# EAGLE design GC2-xHAT-v1.0 (EAGLE 9.2.2)
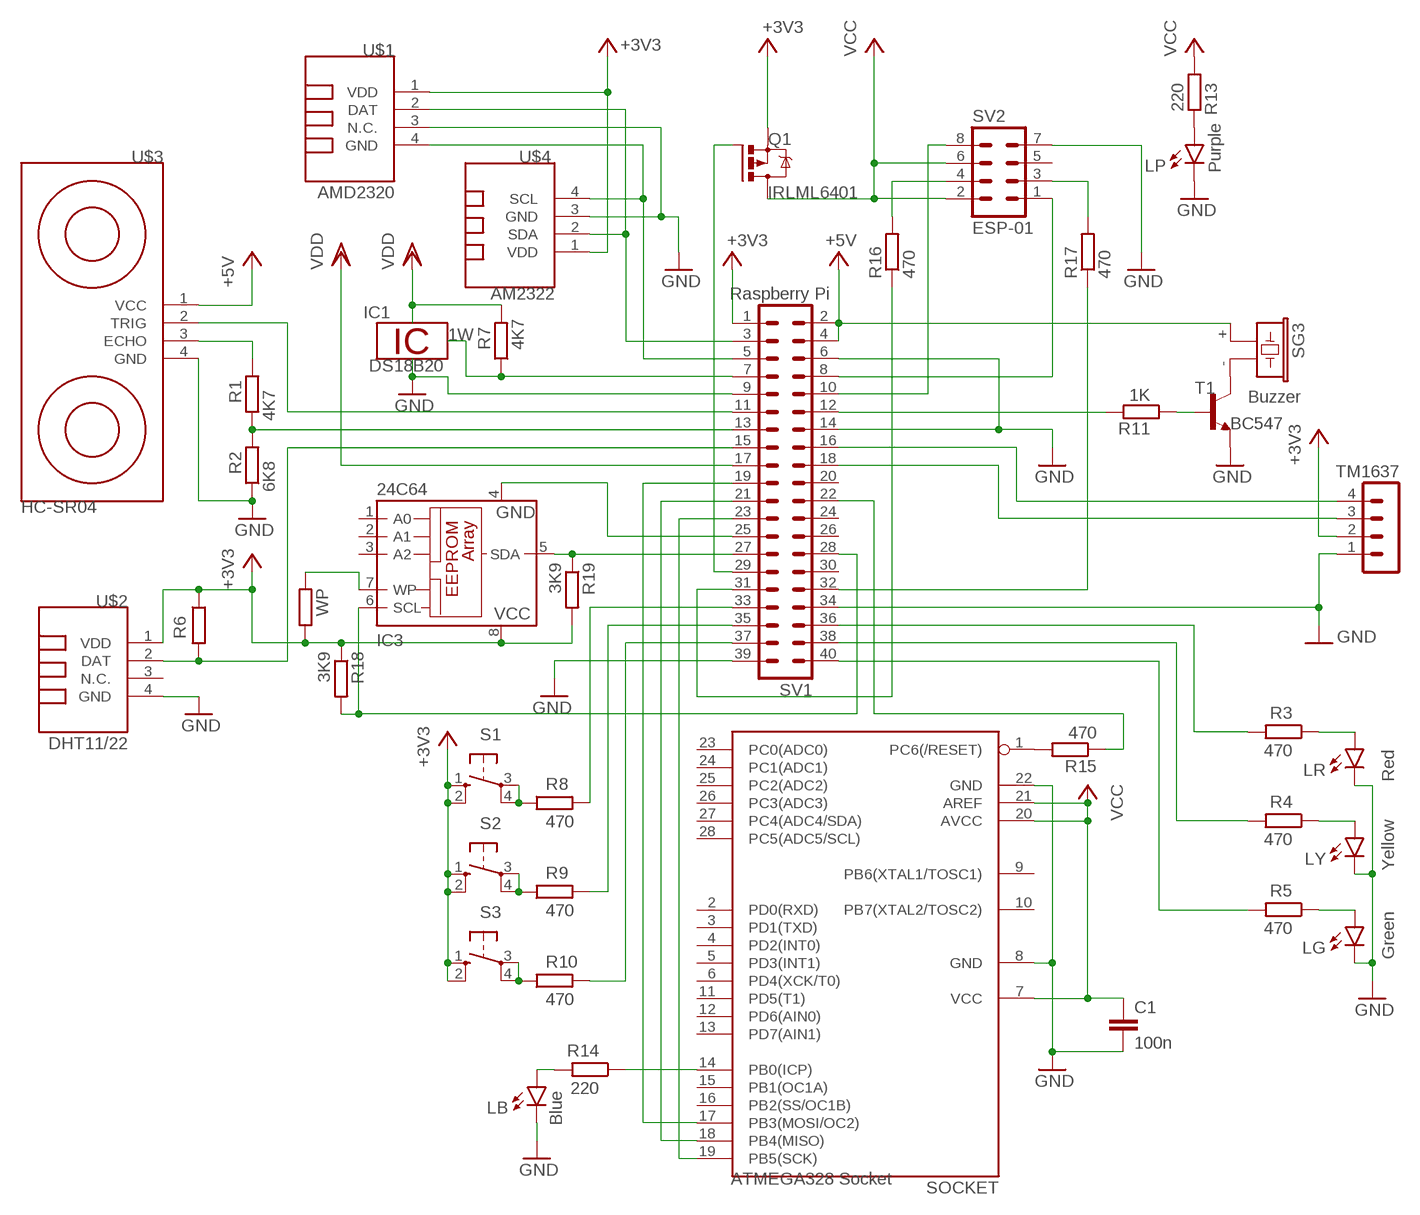
[diagram p0: schematic, sheet 1]

## Parts
C1  100n  C-EU025-024X044  [C025-024X044]
IC1  DS18B20  [TO92-]
IC3  24C64  24C32ASN  [SO-08]
LB  Blue  LED3MM  [LED3MM]
LG  Green  LED3MM  [LED3MM]
LP  Purple  LED3MM  [LED3MM]
LR  Red  LED3MM  [LED3MM]
LY  Yellow  LED3MM  [LED3MM]
Q1  IRLML6401  IRLML5203  [MICRO3]
R1  4K7  R-EU_0309/V  [0309V]
R2  6K8  R-EU_0309/V  [0309V]
R3  470  R-EU_0309/V  [0309V]
R4  470  R-EU_0309/V  [0309V]
R5  470  R-EU_0309/V  [0309V]
R6  4K7  R-EU_0309/V  [0309V]
R7  4K7  R-EU_0309/V  [0309V]
R8  470  R-EU_0309/V  [0309V]
R9  470  R-EU_0309/V  [0309V]
R10  470  R-EU_0309/V  [0309V]
R11  1K  R-EU_0309/V  [0309V]
R13  220  R-EU_0309/V  [0309V]
R14  220  R-EU_0309/V  [0309V]
R15  470  R-EU_0204/7  [0204/7]
R16  470  R-EU_0204/7  [0204/7]
R17  470  R-EU_0204/7  [0204/7]
R18  3K9  R-EU_R1206  [R1206]
R19  3K9  R-EU_R1206  [R1206]
S1  10-XX  [B3F-10XX]
S2  10-XX  [B3F-10XX]
S3  10-XX  [B3F-10XX]
SG3  Buzzer  F/CM12P  [F/CM12P]
SOCKET  ATMEGA328 Socket  MEGA8-P  [DIL28-3]
SV1  Raspberry Pi  MA20-2  [MA20-2]
SV2  ESP-01  MA04-2  [MA04-2]
SW  WP  R-EU_M1406  [M1406]
T1  BC547  [TO92]
TM1637  MA04-1  [MA04-1]
U$1  AMD2320  TEMP-HUM-SENSOR-DHT11  [TEMP-HUM-SENSOR-DHT11]
U$2  DHT11/22  TEMP-HUM-SENSOR-DHT11  [TEMP-HUM-SENSOR-DHT11]
U$3  HC-SR04  ULTRASONIC-HC-SR04#V  [ULTRASONIC-HC-SR04#V]
U$4  AM2322  TEMP-HUM-SENSOR-AM2322  [TEMP-HUM-SENSOR-AM2322]

## Nets
1W: R7.1 SV1.7
+3V3: IC3.8(VCC) Q1.2(S) R6.1 R18.1 R19.2 S1.1(S) S1.2(S1) S2.1(S) S2.2(S1) S3.1(S) S3.2(S1) SV1.1 SW.1 TM1637.2 U$1.1(VDD) U$2.1(VDD) U$4.1(VDD)
+5V: SG3.+ SV1.2 SV1.4 U$3.1(VCC)
GND: C1.2 LB.K(C) LG.K(C) LP.K(C) LR.K(C) LY.K(C) R2.1 SOCKET.8(GND) SOCKET.22(GND) SV1.6 SV1.9 SV1.14 SV1.34 SV1.39 SV2.7 T1.1(E) TM1637.1 U$1.3(N.C.) U$2.4(GND) U$3.4(GND) U$4.3(GND)
N$1: LY.A R4.1
N$2: SV1.3 U$1.2(DAT) U$4.2(SDA)
N$3: SV1.5 U$1.4(GND) U$4.4(SCL)
N$4: R1.1 R2.2 SV1.13
N$5: R9.1 S2.3(P) S2.4(P1)
N$6: SV1.11 U$3.2(TRIG)
N$7: R8.1 S1.3(P) S1.4(P1)
N$8: R11.1 T1.2(B)
N$9: R17.2 SV2.3
N$10: SOCKET.17(PB3(MOSI/OC2)) SV1.19
N$11: SOCKET.18(PB4(MISO)) SV1.21
N$12: SOCKET.19(PB5(SCK)) SV1.23
N$13: LP.A R13.2
N$14: LG.A R5.1
N$15: R8.2 SV1.33
N$16: R9.2 SV1.35
N$17: R10.2 SV1.37
N$18: R17.1 SV1.32
N$19: Q1.1(G) SV1.29
N$20: R15.2 SOCKET.1(PC6(/RESET))
N$21: R14.1 SOCKET.14(PB0(ICP))
N$22: R10.1 S3.3(P) S3.4(P1)
N$23: R16.2 SV2.4
N$24: SV1.8 SV2.1
N$25: SV1.10 SV2.8
N$26: R11.2 SV1.12
N$27: R15.1 SV1.22
N$28: SV1.16 TM1637.4
N$29: R6.2 SV1.15 U$2.2(DAT)
N$30: LB.A R14.2
N$31: IC3.5(SDA) R19.1 SV1.27
N$32: IC3.6(SCL) R18.2 SV1.28
N$33: R16.1 SV1.31
N$37: R4.2 SV1.38
N$38: R3.2 SV1.36
N$39: LR.A R3.1
N$40: SG3.- T1.3(C)
N$41: R1.2 U$3.3(ECHO)
N$42: SV1.18 TM1637.3
N$43: IC3.7(WP) SW.2
N$44: R5.2 SV1.40
N$45: IC3.4(GND) SV1.25
VCC: C1.1 Q1.3(D) R13.1 SOCKET.7(VCC) SOCKET.20(AVCC) SOCKET.21(AREF) SV2.2 SV2.6
VDD: R7.2 SV1.17
Unconnected: IC3.1(A0) IC3.2(A1) IC3.3(A2) SOCKET.2(PD0(RXD)) SOCKET.3(PD1(TXD)) SOCKET.4(PD2(INT0)) SOCKET.5(PD3(INT1)) SOCKET.6(PD4(XCK/T0)) SOCKET.9(PB6(XTAL1/TOSC1)) SOCKET.10(PB7(XTAL2/TOSC2)) SOCKET.11(PD5(T1)) SOCKET.12(PD6(AIN0)) SOCKET.13(PD7(AIN1)) SOCKET.15(PB1(OC1A)) SOCKET.16(PB2(SS/OC1B)) SOCKET.23(PC0(ADC0)) SOCKET.24(PC1(ADC1)) SOCKET.25(PC2(ADC2)) SOCKET.26(PC3(ADC3)) SOCKET.27(PC4(ADC4/SDA)) SOCKET.28(PC5(ADC5/SCL)) SV1.20 SV1.24 SV1.26 SV1.30 SV2.5 U$2.3(N.C.)

## Power pins joined to a net without a drawn wire
1W: IC1.2
GND: IC1.1
VDD: IC1.3

## Library data of the parts
C1 = rcl:C-EU: CAPACITOR, European symbol; SPICEPREFIX: C
IC1 = 1wire:DS18B20: Programmable Resolution Digital Thermometer This chip provides a onewire thermosensor with approx. 0.5°C accuracy. A programmable over/undertemperure alarm is available. The precision can be set from 9..12 bits. Notes: Vdd must be applied for accurate measurements at low temperatures, as the parasite power circuit otherwise heats the sensor. If parasite power is used, Vdd has to be connected to GND. The DS1822 is a low-cost thermometer chip, the DS18S20 is similar to the DS18B20, but with 9 Bit precision only. Author: Jan Kandziora <jjj@gmx.de>
IC3 = microchip:24*: Serial EEPROM I2C; MPN: IS24C32A-2GLI; OC_FARNELL: 1224413; OC_NEWARK: 43M4588
LB LG LP LR LY = led:LED: LED OSRAM: - CHIPLED LG R971, LG N971, LY N971, LG Q971, LY Q971, LO R971, LY R971 LH N974, LH R974 LS Q976, LO Q976, LY Q976 LO Q996 - Hyper CHIPLED LW Q18S LB Q993, LB Q99A, LB R99A - SideLED LS A670, LO A670, LY A670, LG A670, LP A670 LB A673, LV A673, LT A673, LW A673 LH A674 LY A675 LS A676, LA A676, LO A676, LY A676, LW A676 LS A679, LY A679, LG A679 - Hyper Micro SIDELED® LS Y876, LA Y876, LO Y876, LY Y876 LT Y87S - SmartLED LW L88C, LW L88S LB L89C, LB L89S, LG L890 LS L89K, LO L89K, LY L89K LS L896, LA L896, LO L896, LY L896 - TOPLED LS T670, LO T670, LY T670, LG T670, LP T670 LSG T670, LSP T670, LSY T670, LOP T670, LYG T670 LG T671, LOG T671, LSG T671 LB T673, LV T673, LT T673, LW T673 LH T674 LS T676, LA T676, LO T676, LY T676, LB T676, LH T676, LSB T676, LW T676 LB T67C, LV T67C, LT T67C, LS T67K, LO T67K, LY T67K, LW E67C LS E67B, LA E67B, LO E67B, LY E67B, LB E67C, LV E67C, LT E67C LW T67C LS T679, LY T679, LG T679 LS T770, LO T770, LY T770, LG T770, LP T770 LB T773, LV T773, LT T773, LW T773 LH T774 LS E675, LA E675, LY E675, LS T675 LS T776, LA T776, LO T776, LY T776, LB T776 LHGB T686 LT T68C, LB T68C - Hyper Mini TOPLED® LB M676 - Mini TOPLED Santana® LG M470 LS M47K, LO M47K, LY M47K Source: http://www.osram.convergy.de LUXEON: - LUMILED® LXK2-PW12-R00, LXK2-PW12-S00, LXK2-PW14-U00, LXK2-PW14-V00 LXK2-PM12-R00, LXK2-PM12-S00, LXK2-PM14-U00 LXK2-PE12-Q00, LXK2-PE12-R00, LXK2-PE12-S00, LXK2-PE14-T00, LXK2-PE14-U00 LXK2-PB12-K00, LXK2-PB12-L00, LXK2-PB12-M00, LXK2-PB14-N00, LXK2-PB14-P00, LXK2-PB14-Q00 LXK2-PR12-L00, LXK2-PR12-M00, LXK2-PR14-Q00, LXK2-PR14-R00 LXK2-PD12-Q00, LXK2-PD12-R00, LXK2-PD12-S00 LXK2-PH12-R00, LXK2-PH12-S00 LXK2-PL12-P00, LXK2-PL12-Q00, LXK2-PL12-R00 Source: www.luxeon.com KINGBRIGHT: KA-3528ASYC Source: www.kingbright.com
Q1 = transistor-power:IRLML5203: HEXFET P-Channel Power MOSFET
R1-R11 R13-R19 SW = rcl:R-EU_: RESISTOR, European symbol; SPICEPREFIX: R
S1-S3 = switch-omron:10-XX: OMRON SWITCH; MPN: B3F-1000; OC_FARNELL: 176432; OC_NEWARK: 36M3542
SG3 = buzzer:F/CM12P: BUZZER Source: Buerklin; OC_FARNELL: unknown; OC_NEWARK: unknown
SOCKET = atmel:MEGA8-P: MICROCONTROLLER 8 Kbytes FLASH, 1 kbytes SRAM, 512 bytes EEPROM, USART, 4-channel 10 bit ADC, 2-channel 8 bit ADC Pin compatible with Atmega48, ATMega88, ATMega168 Source: avr.lbr; OC_FARNELL: unknown; OC_NEWARK: unknown
SV1 = con-lstb:MA20-2: PIN HEADER; OC_FARNELL: unknown; OC_NEWARK: unknown
SV2 = con-lstb:MA04-2: PIN HEADER; OC_FARNELL: unknown; OC_NEWARK: unknown
T1 = transistor-neu-to92:BC547: NPN TRANSISTOR
TM1637 = con-lstb:MA04-1: PIN HEADER; OC_FARNELL: unknown; OC_NEWARK: unknown
U$1 U$2 = diy-modules:TEMP-HUM-SENSOR-DHT11: DHT11 - digital humidity & temperature sensor DHT11 datasheet available here: https://akizukidenshi.com/download/ds/aosong/DHT11.pdf Click here to find device on ebay.com <http://www.ebay.com/sch/dht11+digital+sensor>
U$3 = diy-modules:ULTRASONIC-HC-SR04: Ultrasonic Ranging Module HC-SR04 More details available here: http://randomnerdtutorials.com/complete-guide-for-ultrasonic-sensor-hc-sr04/ Click here to find device on ebay.com <http://www.ebay.com/sch/hc+sr04+ultrasonic>
U$4 = diy-modules:TEMP-HUM-SENSOR-AM2322: AM2322 - digital humidity & temperature sensor More information about AM2322 is available here: http://www.electrodragon.com/w/AM2322 Click here to find device on ebay.com <http://www.ebay.com/sch/am2322+digital+sensor>

## Net classes
0 default: width 0.254 mm

## Board
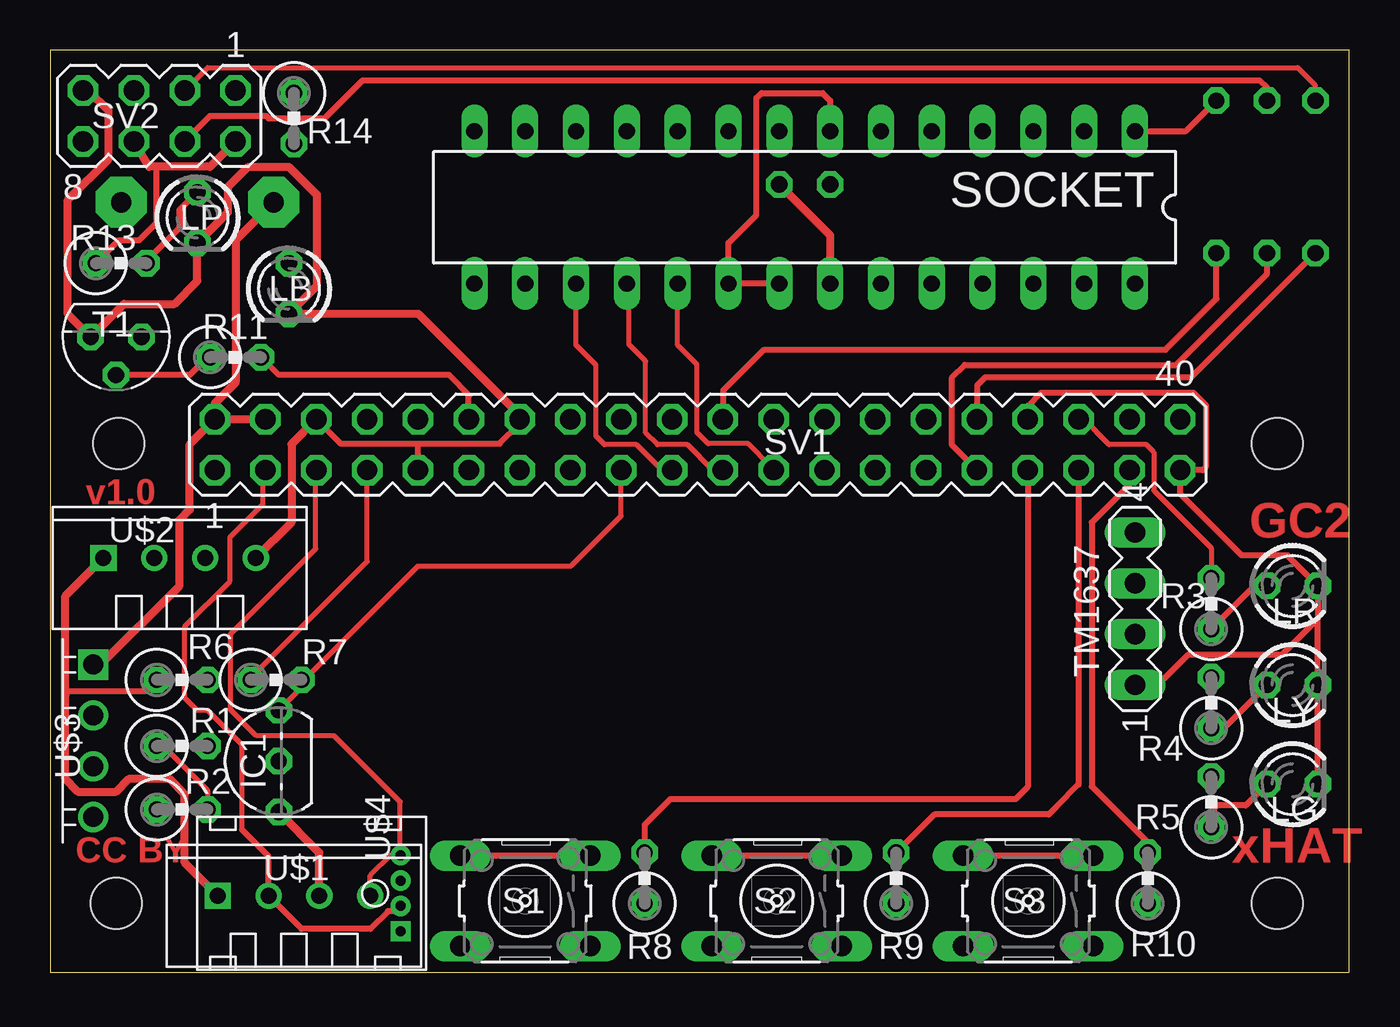
[diagram p1: board, top side]
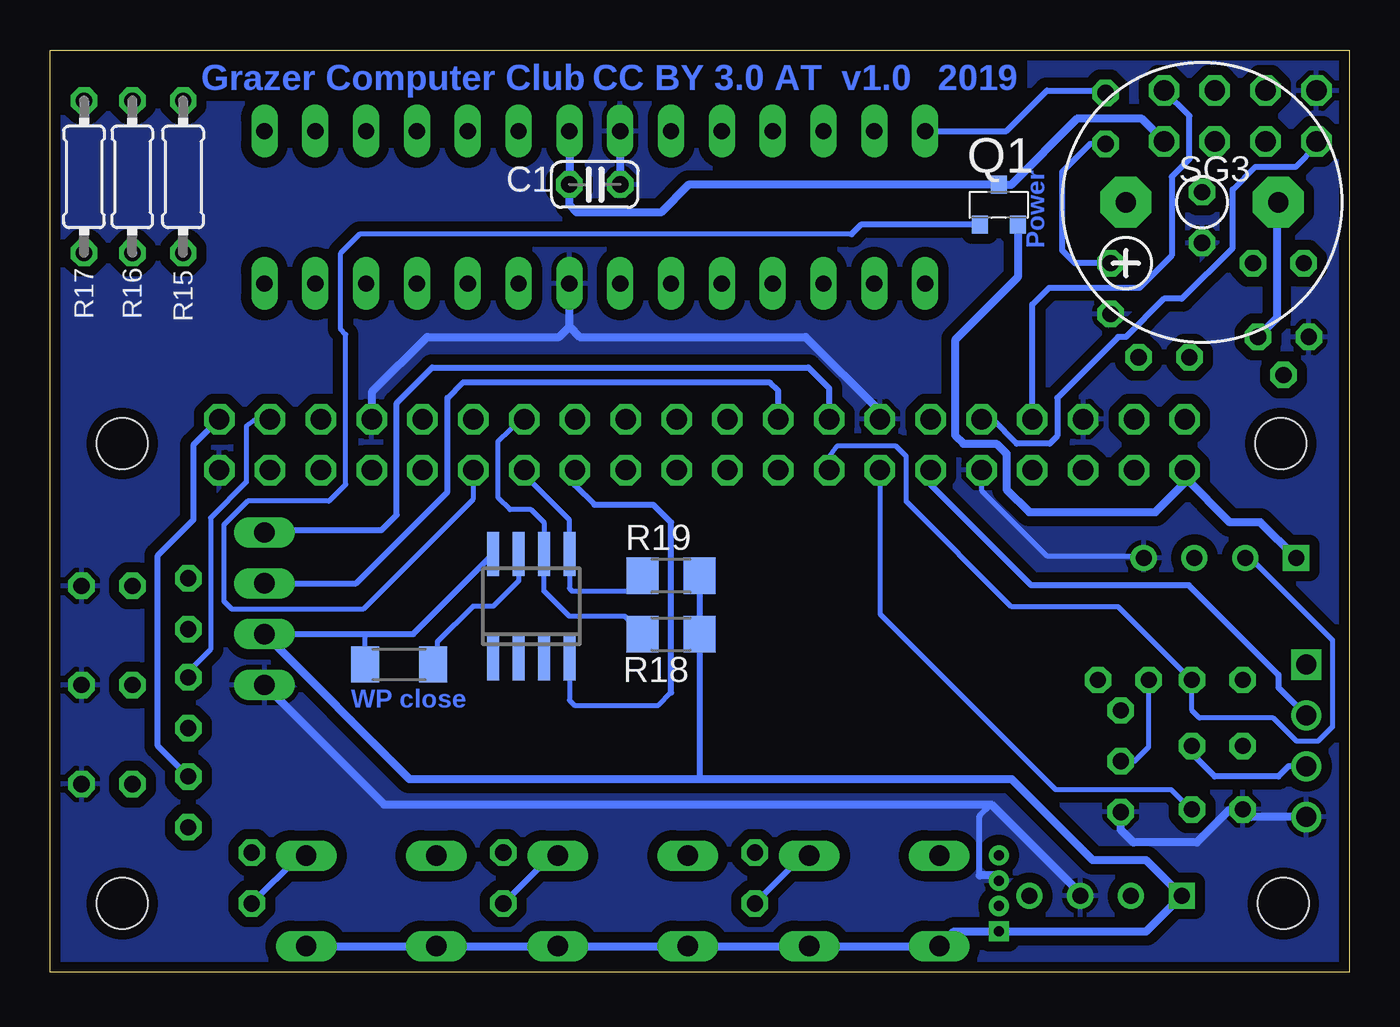
[diagram p2: board, bottom side, seen from below]

Size 64.95 x 46.09 mm. Coordinates in mm from the lower left corner, seen from the top.
Outline: 0,0 64.95,0 64.95,46.09 0,46.09 0,0
Copper layers (1*16): Top 0.035mm / dielectric 1.5mm / Bottom 0.035mm
Design rules "default *": minimum track width 6mil, minimum drill 0.35mm, track to track 6mil, track to pad 6mil, pad to pad 6mil, via to via 6mil, smd to smd 6mil, copper to edge 20mil, drill to drill 6mil, minimum pad ring 10mil, minimum via ring 8mil, stop-mask expansion 4mil, vias tented up to drill 0mil, thermal gap 10mil
Holes 2.54 mm at 3.43,26.42 61.34,26.42 61.34,3.43 3.3,3.43

### Footprints (pad centres in the part's own frame; a part is rotated, then mirrored left to right if it is on the bottom)
C025-024X044 = drill 0.813 octagon: 1 -1.27,0; 2 1.27,0
TO92- = drill 0.813 octagon: 1 -2.54,0; 2 0,0; 3 2.54,0
SO-08 = smd 0.6 x 2.2: 1 -1.905,-2.6; 2 -0.635,-2.6; 3 0.635,-2.6; 4 1.905,-2.6; 5 1.905,2.6; 6 0.635,2.6; 7 -0.635,2.6; 8 -1.905,2.6
LED3MM = drill 0.813 octagon: A -1.27,0; K 1.27,0
MICRO3 = smd 0.8 x 0.9: 1 -0.95,-1; 2 0.95,-1; 3 0,1
0309V = drill 0.813 octagon: 1 -1.27,0; 2 1.27,0
0204/7 = drill 0.813 octagon: 1 -3.81,0; 2 3.81,0
R1206 = smd 1.6 x 1.803: 1 -1.422,0; 2 1.422,0
B3F-10XX = drill 1.016 long: 1 -3.251,2.261; 2 3.251,2.261; 3 -3.251,-2.261; 4 3.251,-2.261
F/CM12P = drill 1.016 pad 2.54 octagon: + 3.81,0; - -3.81,0
DIL28-3 = drill 0.813 long: 1 -16.51,-3.81; 2 -13.97,-3.81; 3 -11.43,-3.81; 4 -8.89,-3.81; 5 -6.35,-3.81; 6 -3.81,-3.81; 7 -1.27,-3.81; 8 1.27,-3.81; 9 3.81,-3.81; 10 6.35,-3.81; 11 8.89,-3.81; 12 11.43,-3.81; 13 13.97,-3.81; 14 16.51,-3.81; 15 16.51,3.81; 16 13.97,3.81; 17 11.43,3.81; 18 8.89,3.81; 19 6.35,3.81; 20 3.81,3.81; 21 1.27,3.81; 22 -1.27,3.81; 23 -3.81,3.81; 24 -6.35,3.81; 25 -8.89,3.81; 26 -11.43,3.81; 27 -13.97,3.81; 28 -16.51,3.81
MA20-2 = drill 1.016 octagon: 1 -24.13,-1.27; 2 -24.13,1.27; 3 -21.59,-1.27; 4 -21.59,1.27; 5 -19.05,-1.27; 6 -19.05,1.27; 7 -16.51,-1.27; 8 -16.51,1.27; 9 -13.97,-1.27; 10 -13.97,1.27; 11 -11.43,-1.27; 12 -11.43,1.27; 13 -8.89,-1.27; 14 -8.89,1.27; 15 -6.35,-1.27; 16 -6.35,1.27; 17 -3.81,-1.27; 18 -3.81,1.27; 19 -1.27,-1.27; 20 -1.27,1.27; 21 1.27,-1.27; 22 1.27,1.27; 23 3.81,-1.27; 24 3.81,1.27; 25 6.35,-1.27; 26 6.35,1.27; 27 8.89,-1.27; 28 8.89,1.27; 29 11.43,-1.27; 30 11.43,1.27; 31 13.97,-1.27; 32 13.97,1.27; 33 16.51,-1.27; 34 16.51,1.27; 35 19.05,-1.27; 36 19.05,1.27; 37 21.59,-1.27; 38 21.59,1.27; 39 24.13,-1.27; 40 24.13,1.27
MA04-2 = drill 1.016 octagon: 1 -3.81,-1.27; 2 -3.81,1.27; 3 -1.27,-1.27; 4 -1.27,1.27; 5 1.27,-1.27; 6 1.27,1.27; 7 3.81,-1.27; 8 3.81,1.27
M1406 = smd 1.4 x 1.8: 1 -1.7,0; 2 1.7,0
TO92 = drill 0.813 octagon: 1 1.27,0; 2 0,1.905; 3 -1.27,0
MA04-1 = drill 1.016 long: 1 -3.81,0; 2 -1.27,0; 3 1.27,0; 4 3.81,0
TEMP-HUM-SENSOR-DHT11 = drill 0.8 square: 1 -3.81,0 | drill 0.8: 2 -1.27,0; 3 1.27,0; 4 3.81,0
ULTRASONIC-HC-SR04#V = drill 1 square: 1 -3.81,0 | drill 1: 2 -1.27,0; 3 1.27,0; 4 3.81,0
TEMP-HUM-SENSOR-AM2322 = drill 0.5 square: 1 -1.905,-4.445 | drill 0.5: 2 -0.635,-4.445; 3 0.635,-4.445; 4 1.905,-4.445

### Placement (x,y rotation side)
C1  37.72,39.37 0 bottom
IC1  11.43,10.54 90 top
IC3  40.89,18.29 0 bottom
LB  11.94,34.16 270 top
LG  62.1,9.4 0 top
LP  7.37,37.72 270 top
LR  62.1,19.3 0 top
LY  62.1,14.35 0 top
Q1  17.53,38.35 0 bottom
R1  6.6,11.3 0 top
R2  6.6,8.13 0 top
R3  58.04,18.42 90 top
R4  58.04,13.46 90 top
R5  58.04,8.51 90 top
R6  6.6,14.6 0 top
R7  11.3,14.6 0 top
R8  29.72,4.7 90 top
R9  42.29,4.7 90 top
R10  54.86,4.7 90 top
R11  9.27,30.73 0 top
R13  3.56,35.43 0 top
R14  12.19,42.67 270 top
R15  58.29,39.75 90 bottom
R16  60.83,39.75 90 bottom
R17  63.25,39.75 90 bottom
R18  33.91,16.89 180 bottom
R19  33.91,19.81 0 bottom
S1  23.75,3.56 180 top
S2  36.32,3.56 180 top
S3  48.89,3.56 180 top
SG3  7.37,38.48 180 bottom
SOCKET  37.72,38.23 180 top
SV1  32.36,26.37 0 top
SV2  5.46,42.8 180 top
SW  47.5,15.37 0 bottom
T1  3.3,31.75 180 top
TM1637  54.23,18.16 90 top
U$1  12.19,3.81 0 top
U$2  6.48,20.7 0 top
U$3  2.16,11.56 270 top
U$4  13.08,3.94 90 top

### Tracks (layer width: path | path; a pad name or v marks a point on that pad's centre or on a via)
1W
  Top 0.254: SV1.7 15.85,20.52 10.03,14.71 R7.1
  Bottom 0.254: R7.1 10.03,11.25 10.74,10.54 IC1.2
+3V3
  Top 0.305: 0.76,13.84 0.97,14.05 4.78,14.05 R6.1
  Top 0.406: U$1.1 6.73,5.46 6.73,8.89 5.97,9.65 3.94,9.65 3.3,9.02 1.4,9.02 0.76,9.65 0.76,13.84 0.76,18.8 U$2.1
  Bottom 0.254: SW.1 49.2,16.84 49.15,16.89
  Bottom 0.305: TM1637.2 49.15,16.89 46.8,16.89 IC3.8 | R19.2 R18.1 32.49,9.68 32.51,9.65
  Bottom 0.406: TM1637.2 46.99,9.65 32.51,9.65 16.89,9.65 12.83,5.59 10.16,5.59 U$1.1 10.16,2.03 U$4.1 19.76,2.03 S1.2 S1.1 S2.2 S2.1 S3.2 S3.1 | U$2.1 4.45,22.48 5.97,22.48 8.23,24.74 SV1.1 8.23,24.46 9.7,22.99 16,22.99 17.14,24.13 17.14,25.91 17.65,26.42 19.3,26.42 19.69,26.8 19.69,31.62 16.58,34.73 Q1.2
+5V
  Top 0.406: SV1.2 8.23,28.42 9.27,29.46 9.27,36.58 SG3.+ | SV1.2 6.99,26.39 6.99,23.11 6.48,22.61 6.48,19.3 2.54,15.37 U$3.1 | SV1.2 SV1.4
GND
  Top 0.254: 23.52,27.64 SV1.14 23.47,27.41
  Top 0.305: TM1637.1 55.37,14.35 56.9,15.87 61.59,15.87 63.37,17.65 | LG.K LY.K 63.37,17.65 | 63.37,17.65 LR.K 61.85,20.83 59.56,20.83 56.49,23.9 SV1.39 57.61,25.1 57.78,25.27 57.78,28.32 57.15,28.96 49.53,28.96 48.87,28.3 SV1.34 | SV1.6 14.53,26.42 18.42,26.42 | 23.47,27.41 22.48,26.42 18.42,26.42 | SV1.9 18.39,26.39 18.42,26.42
  Top 0.406: 23.52,27.64 23.52,27.79 18.42,32.89 LB.K 13.33,34.29 13.33,38.86 11.94,40.26 9.91,40.26 8.89,39.24 8.89,37.97 LP.K 7.37,34.54 6.22,33.4 3.68,33.4 T1.1 0.89,32.89 0.89,38.61 2.92,40.64 2.92,43.05 1.91,44.07 SV2.7 | U$1.3 13.46,5.97 IC1.1 | C1.2 38.99,36.83 SOCKET.22 | SV1.6 12.06,26.39 12.06,22.48 U$2.4
  Bottom 0.254: SV1.9 18.39,24.08 15.11,20.8 10.29,20.8 U$2.4
  Bottom 0.305: 18.49,4.83 18.49,7.8 17.91,8.38
  Bottom 0.406: SOCKET.8 C1.2 | TM1637.1 48.26,8.38 17.91,8.38 13.46,3.94 U$1.3 | 38.99,32.26 39.5,31.75 46.1,31.75 48.87,28.98 SV1.34 | 38.99,32.26 38.48,31.75 27.18,31.75 23.47,28.04 SV1.14 | IC1.1 11.43,7.11 10.79,6.48 7.62,6.48 5.97,8.13 R2.1 4.95,7.75 U$3.4 | 38.99,32.26 SOCKET.22 | 18.49,4.83 17.78,4.83 U$4.3
  pour Bottom (isolate 0.508): 0.38,45.59 64.64,45.59 64.64,0.38 0.38,0.38
N$1
  Top 0.305: LY.A 58.67,12.19 R4.1
N$2
  Top 0.254: SV1.3 10.64,25.07 10.64,23.39 8.99,21.74 8.99,19.53 6.73,17.27 6.73,13.72 7.37,13.08 7.87,13.08 9.6,11.35 9.6,7.11
  Top 0.305: 9.6,7.11 10.92,5.79 U$1.2 12.57,2.16 16,2.16 16.89,3.05 17.27,3.05 U$4.2
N$3
  Top 0.254: U$1.4 16,4.83 17.02,5.84 U$4.4 17.5,5.84 17.5,8.51 14.2,11.81 10.31,11.81 9.02,13.11 9.02,16.89 13.28,21.16 13.28,25.07 SV1.5
N$4
  Top 0.254: R1.1 5.66,11.3 7.87,9.09 R2.2
  Bottom 0.254: SV1.13 23.44,25.07 23.44,17.88 14.68,9.12 8.91,9.12 7.92,8.13 R2.2
N$5
  Top 0.305: S2.3 S2.4
  Bottom 0.305: R9.1 39.9,5.82 S2.3
N$6
  Bottom 0.305: SV1.11 20.93,24.36 15.9,19.33 8.03,19.33 3.56,14.86 3.56,14.22 U$3.2
N$7
  Top 0.305: S1.3 S1.4
  Bottom 0.305: R8.1 27.33,5.82 S1.3
N$8
  Top 0.305: R11.1 7.87,30.73 6.99,29.85 T1.2
N$9
  Top 0.254: R17.2 63.25,44.32 62.36,45.21 7.87,45.21 SV2.3
N$10
  Top 0.254: SOCKET.17 26.29,31.34 27.28,30.35 27.28,26.8 27.71,26.37 29.31,26.37 30.58,25.1 SV1.19
N$11
  Top 0.254: SV1.21 33.12,25.1 31.85,26.37 30.35,26.37 29.77,26.95 29.77,30.53 28.93,31.37 28.93,34.42 SOCKET.18
N$12
  Top 0.254: SOCKET.19 31.37,31.34 32.33,30.38 32.33,26.98 32.89,26.42 34.9,26.42 36.04,25.27 SV1.23
N$13
  Top 0.305: R13.2 4.83,35.56 6.48,37.21 6.48,38.1 LP.A
N$14
  Top 0.305: LG.A 59.76,8.33 58.34,8.33 58.16,8.15 58.16,7.36 R5.1
N$15
  Top 0.305: SV1.33 48.87,9.25 48.26,8.64 30.99,8.64 29.72,7.37 R8.2
N$16
  Top 0.305: SV1.35 51.41,9.37 50.29,8.25 49.91,7.87 44.2,7.87 R9.2
N$17
  Top 0.305: SV1.37 53.95,24.36 52.07,22.48 52.07,9.27 54.86,6.48 R10.2
N$18
  Top 0.305: R17.1 57.02,29.72 46.74,29.72 46.33,29.31 SV1.32
N$19
  Bottom 0.254: 24.89,36.88 49.48,36.88 50.42,35.94 50.42,32.13 50.16,31.88 50.16,24.38 51,23.55 55.07,23.55 56.26,22.35 56.26,18.54 55.88,18.16 49.28,18.16 43.79,23.65 SV1.29
  Bottom 0.305: Q1.1 24.42,37.35 24.89,36.88
N$20
  Top 0.305: SOCKET.1 56.77,42.04 R15.2
N$21
  Bottom 0.305: R14.1 12.32,44.07 15.11,44.07 17.14,42.04 SOCKET.14
N$22
  Top 0.305: S3.3 S3.4
  Bottom 0.305: R10.1 52.48,5.82 S3.3
N$23
  Top 0.305: SV2.4 8,42.8 10.79,42.8 10.92,42.67 13.72,42.67 15.62,44.58 60.45,44.58 60.83,44.2 R16.2
N$24
  Bottom 0.305: SV1.8 15.85,33.38 15.01,34.21 10.49,34.21 8.89,35.81 8.89,39.75 8,40.64 8,42.8 SV2.1
N$25
  Bottom 0.305: SV2.8 1.65,41.3 2.69,40.26 4.7,40.26 5.84,39.12 5.84,36.2 8.38,33.65 9.27,33.65 11.18,31.75 11.56,31.75 14.6,28.7 14.6,26.8 14.99,26.42 16.64,26.42 17.86,27.64 SV1.10
N$26
  Top 0.305: SV1.12 20.93,28.8 20.96,28.83 19.94,29.85 11.43,29.85 R11.2
N$27
  Top 0.305: SV1.22 33.65,27.66 33.65,29.08 35.69,31.12 55.75,31.12 58.29,33.65 R15.1
N$28
  Bottom 0.305: TM1637.4 54.1,22.1 48.39,22.1 47.62,22.86 47.62,28.45 45.85,30.23 27.05,30.23 26.01,29.19 SV1.16
N$29
  Bottom 0.254: U$2.2 4.95,20.7 0.84,16.59 0.84,12.27 1.57,11.53 2.64,11.53 3.81,12.7 7.49,12.7 7.87,13.08 7.87,14.58 | 7.87,14.58 11.56,18.26 16.89,18.26 22.15,23.52 22.15,25.78 22.66,26.29 25.63,26.29 26.01,25.76 SV1.15 | 7.87,14.58 R6.2
N$30
  Bottom 0.305: LB.A 13.72,35.43 14.35,36.07 14.35,40 12.95,41.4 R14.2
N$31
  Bottom 0.254: SV1.27 41.25,24.87 38.99,22.61 IC3.5 38.99,19.18 38.86,19.05 35.94,19.05 35.94,19.2 R19.1
N$32
  Bottom 0.254: SV1.28 41.39,27.64 42.54,26.55 42.54,23.7 41.96,23.11 40.89,23.11 40.26,22.48 IC3.6 40.26,19.05 38.99,17.78 36.22,17.78 R18.2
N$33
  Top 0.305: SV1.31 45.09,26.34 45.09,29.72 45.72,30.35 56.26,30.35 60.83,34.92 R16.1
N$37
  Bottom 0.254: R4.2 57.99,14.86 57.99,15.06 56.92,16.13 56.92,22.71 55.14,24.49 55.14,27.29 54.66,27.64 SV1.38
N$38
  Top 0.254: SV1.36 51.66,27.64 52.93,26.37 54.79,26.37 55.17,25.98 55.17,24.08 58.04,21.21 R3.2
N$39
  Top 0.305: LR.A 60.2,19.3 R3.1
N$40
  Bottom 0.406: SG3.- 3.63,38.4 3.63,32.69 T1.3
N$41
  Bottom 0.305: U$3.3 3.05,10.29 3.56,9.78 6.73,9.78 7.87,10.92 R1.2
N$42
  Bottom 0.305: SV1.18 28.55,29.06 28.96,29.46 44.32,29.46 45.09,28.7 45.09,24 49.66,19.43 TM1637.3
N$43
  Bottom 0.254: IC3.7 41.53,19.56 42.8,18.29 43.81,18.29 45.59,16.51 45.59,15.57 SW.2
N$44
  Bottom 0.305: SV1.40 57.78,26.34 57.78,22.61 59.56,20.83 59.56,11.3 R5.2
N$45
  Bottom 0.254: IC3.4 38.99,13.59 38.73,13.33 34.54,13.33 33.91,13.97
  Bottom 0.305: SV1.25 38.71,24.33 37.74,23.37 34.8,23.37 33.91,22.48 33.91,13.97
VCC
  Top 0.305: SOCKET.7 38.99,43.56 38.61,43.94 35.56,43.94 35.31,43.69 35.31,37.85 33.91,36.45 SOCKET.20 SOCKET.21 | R13.1 3.43,36.58 4.45,36.58 5.33,37.46 5.33,40.26
  Top 0.406: SV2.2 8,40.26 5.33,40.26 4.95,40.26 SV2.6
  Bottom 0.406: SOCKET.7 C1.1 38.99,38.35 38.61,37.97 34.42,37.97 33.04,39.35 Q1.3 16.91,39.35 13.59,42.67 10.41,42.67 SV2.2
VDD
  Top 0.254: IC1.3 11.46,13.1 11.46,13.11 12.57,14.22 R7.2 12.7,14.6 18.39,20.3 26.04,20.3 28.55,22.81 SV1.17

### Text on the board
Top: v1.0 | GC2 | CC BY | xHAT
Bottom: 2019 | v1.0 | CC BY 3.0 AT | Grazer Computer Club | Power | WP close